# EAGLE design project1 (EAGLE 9.5.0)
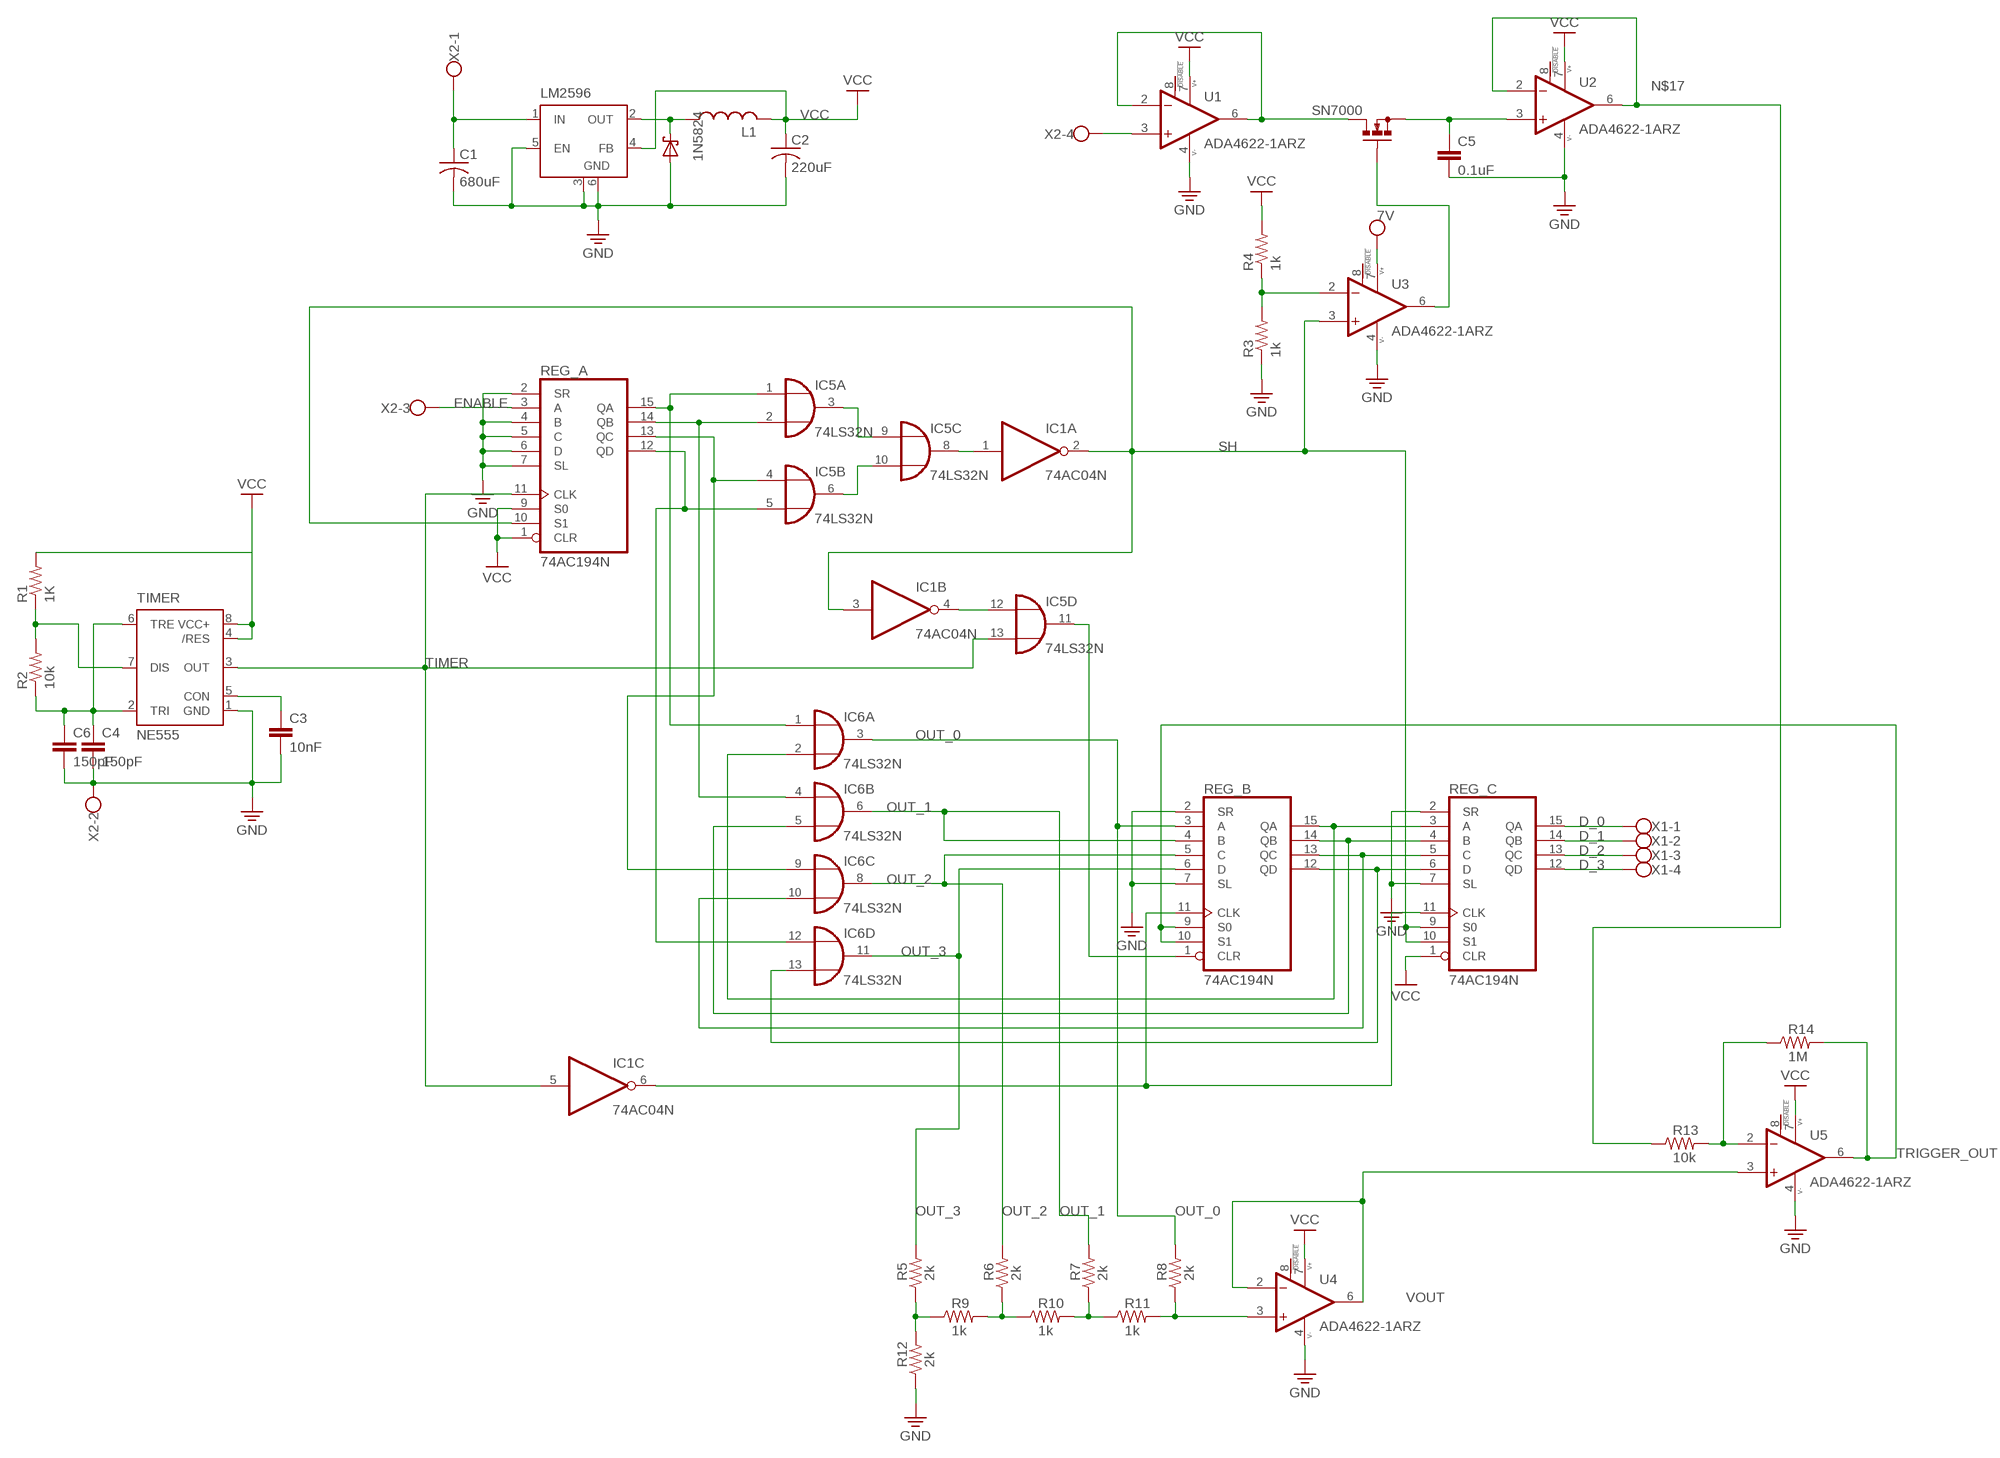
[diagram p0: schematic, sheet 1]

## Parts
1N5824  SCHOTTKY-DIODECB417-15  [CB417-15]
C1  680uF  C-US025-024X044  [C025-024X044]
C2  220uF  C-US025-024X044  [C025-024X044]
C3  10nF  C-EU050-024X044  [C050-024X044]
C4  150pF  C-EU050-024X044  [C050-024X044]
C5  0.1uF  C-EU050-024X044  [C050-024X044]
C6  150pF  C-EU050-024X044  [C050-024X044]
IC1  74AC04N  [DIL14]
IC5  74LS32N  [DIL14]
IC6  74LS32N  [DIL14]
L1  L-US0204/7  [0204/7]
LM2596  LM2596S  [TO263-5]
R1  1K  R-US_0204/7  [0204/7]
R2  10k  R-US_0204/7  [0204/7]
R3  1k  R-US_0204/7  [0204/7]
R4  1k  R-US_0204/7  [0204/7]
R5  2k  R-US_0204/7  [0204/7]
R6  2k  R-US_0204/7  [0204/7]
R7  2k  R-US_0204/7  [0204/7]
R8  2k  R-US_0204/7  [0204/7]
R9  1k  R-US_0204/7  [0204/7]
R10  1k  R-US_0204/7  [0204/7]
R11  1k  R-US_0204/7  [0204/7]
R12  2k  R-US_0204/7  [0204/7]
R13  10k  R-US_0204/7  [0204/7]
R14  1M  R-US_0204/7  [0204/7]
REG_A  74AC194N  [DIL16]
REG_B  74AC194N  [DIL16]
REG_C  74AC194N  [DIL16]
SN7000  BS170  [SOT54E]
TIMER  NE555  [DIL-08]
U1  ADA4622-1ARZ  [SOIC127P600X175-8N]
U2  ADA4622-1ARZ  [SOIC127P600X175-8N]
U3  ADA4622-1ARZ  [SOIC127P600X175-8N]
U4  ADA4622-1ARZ  [SOIC127P600X175-8N]
U5  ADA4622-1ARZ  [SOIC127P600X175-8N]
X1  W237-4  [W237-4]
X2  W237-4  [W237-4]

## Nets
D_0: REG_C.15(QA) X1.1
D_1: REG_C.14(QB) X1.2
D_2: REG_C.13(QC) X1.3
D_3: REG_C.12(QD) X1.4
ENABLE: REG_A.3(A) X2.3
GND: 1N5824.A C1.2 C2.2 C3.2 C4.2 C5.2 C6.2 LM2596.3(GND) LM2596.5(EN) LM2596.6(GND) R3.1 R12.1 REG_A.2(SR) REG_A.4(B) REG_A.5(C) REG_A.6(D) REG_A.7(SL) REG_B.2(SR) REG_B.7(SL) REG_C.2(SR) REG_C.7(SL) TIMER.1(GND) U1.4(V-) U2.4(V-) U3.4(V-) U4.4(V-) U5.4(V-) X2.2
N$1: IC5.1(A:I0) IC6.1(A:I0) REG_A.15(QA)
N$2: IC5.2(A:I1) IC6.4(B:I0) REG_A.14(QB)
N$3: IC5.4(B:I0) IC6.9(C:I0) REG_A.13(QC)
N$4: IC5.5(B:I1) IC6.12(D:I0) REG_A.12(QD)
N$5: IC5.6(B:O) IC5.10(C:I1)
N$6: IC5.3(A:O) IC5.9(C:I0)
N$7: IC1.1(A:I) IC5.8(C:O)
N$8: IC1.4(B:O) IC5.12(D:I0)
N$10: C3.1 TIMER.5(CON)
N$14: IC5.11(D:O) REG_B.1(CLR)
N$15: R1.1 R2.2 TIMER.7(DIS)
N$16: C4.1 C6.1 R2.1 TIMER.2(TRI) TIMER.6(TRE)
N$17: R13.1 U2.2(-IN) U2.6(OUT)
N$21: IC1.6(C:O) REG_B.11(CLK) REG_C.11(CLK)
N$22: 1N5824.C L1.1 LM2596.2(OUT)
N$23: SN7000.D U1.2(-IN) U1.6(OUT)
N$24: R3.2 R4.1 U3.2(-IN)
N$25: R6.1 R9.2 R10.1
N$26: C5.1 SN7000.S U2.3(+IN)
N$27: SN7000.G U3.6(OUT)
N$28: R7.1 R10.2 R11.1
N$29: R5.1 R9.1 R12.2
N$30: R8.1 R11.2 U4.3(+IN)
N$31: R13.2 R14.1 U5.2(-IN)
O0: IC6.2(A:I1) REG_B.15(QA) REG_C.3(A)
O1: IC6.5(B:I1) REG_B.14(QB) REG_C.4(B)
O2: IC6.10(C:I1) REG_B.13(QC) REG_C.5(C)
O3: IC6.13(D:I1) REG_B.12(QD) REG_C.6(D)
OUT_0: IC6.3(A:O) R8.2 REG_B.3(A)
OUT_1: IC6.6(B:O) R7.2 REG_B.4(B)
OUT_2: IC6.8(C:O) R6.2 REG_B.5(C)
OUT_3: IC6.11(D:O) R5.2 REG_B.6(D)
SH: IC1.2(A:O) IC1.3(B:I) REG_A.10(S1) REG_C.9(S0) REG_C.10(S1) U3.3(+IN)
TIMER: IC1.5(C:I) IC5.13(D:I1) REG_A.11(CLK) TIMER.3(OUT)
TRIGGER_OUT: R14.2 REG_B.9(S0) REG_B.10(S1) U5.6(OUT)
V_IN: U1.3(+IN) X2.4
VCC: C2.1 L1.2 LM2596.4(FB) R1.2 R4.2 REG_A.1(CLR) REG_A.9(S0) REG_C.1(CLR) TIMER.4(/RES) TIMER.8(VCC+) U1.7(V+) U2.7(V+) U3.7(V+) U4.7(V+) U5.7(V+) ; supply symbol labelled 7V
VIN: C1.1 LM2596.1(IN) X2.1
VOUT: U4.2(-IN) U4.6(OUT) U5.3(+IN)
Unconnected: IC1.8(D:O) IC1.9(D:I) IC1.10(E:O) IC1.11(E:I) IC1.12(F:O) IC1.13(F:I) U1.8(!DISABLE) U2.8(!DISABLE) U3.8(!DISABLE) U4.8(!DISABLE) U5.8(!DISABLE)

## Power pins joined to a net without a drawn wire
GND: IC1.7(P:GND) IC5.7(P:GND) IC6.7(P:GND) REG_A.8(GND) REG_B.8(GND) REG_C.8(GND)
VCC: IC1.14(P:VCC) IC5.14(P:VCC) IC6.14(P:VCC) REG_A.16(VCC) REG_B.16(VCC) REG_C.16(VCC)

## Library data of the parts
1N5824 = adafruit:SCHOTTKY-DIODE: Schottky Diode
C1 C2 = adafruit:C-US: CAPACITOR, American symbol
C3-C6 = rcl:C-EU: CAPACITOR, European symbol; SPICEPREFIX: C
IC1 = 74xx-eu:74*04: Hex INVERTER
IC5 IC6 = 74xx-eu:74*32: Quad 2-input OR gate
L1 = rcl:L-US: INDUCTOR, American symbol; SPICEPREFIX: L
LM2596 = linear:LM2596S: STEP-DOWN VOLTAGE REGULATOR
R1-R14 = BeagleBone_Black_Wireless:R-US_: RESISTOR, American symbol
REG_A REG_B REG_C = 74xx-eu:74*194: 4-bit bidirectional SHIFT REGISTER
SN7000 = transistor-small-signal:BS170: N-CHANNEL MOS FET
TIMER = st-microelectronics:NE555: General purpose bipolar Timer; MF: Arrow Electronics; MPN: NE555N; OC_FARNELL: 1467742; OC_NEWARK: 89K1486
U1-U5 = ADA4622-1ARZ:ADA4622-1ARZ: J-FET Amplifier 1 Circuit Rail-to-Rail 8-SOIC Check prices <https://pricing.snapeda.com/parts/ADA4622-1ARZ/Analog%20Devices/view-part?ref=eda>; AVAILABILITY: Good; DESCRIPTION: J-FET Amplifier 1 Circuit Rail-to-Rail 8-SOIC; MF: Analog Devices; MP: ADA4622-1ARZ; PACKAGE: SOIC-8 Analog Devices; PRICE: None; PURCHASE-URL: https://pricing.snapeda.com/search/part/ADA4622-1ARZ/?ref=eda
X1 X2 = con-wago-500:W237-4: WAGO SCREW CLAMP; OC_FARNELL: unknown; OC_NEWARK: unknown

## Net classes
0 default: width 0.381 mm, clearance 0.889 mm
1 ground: width 0.381 mm, clearance 0.889 mm

## Board
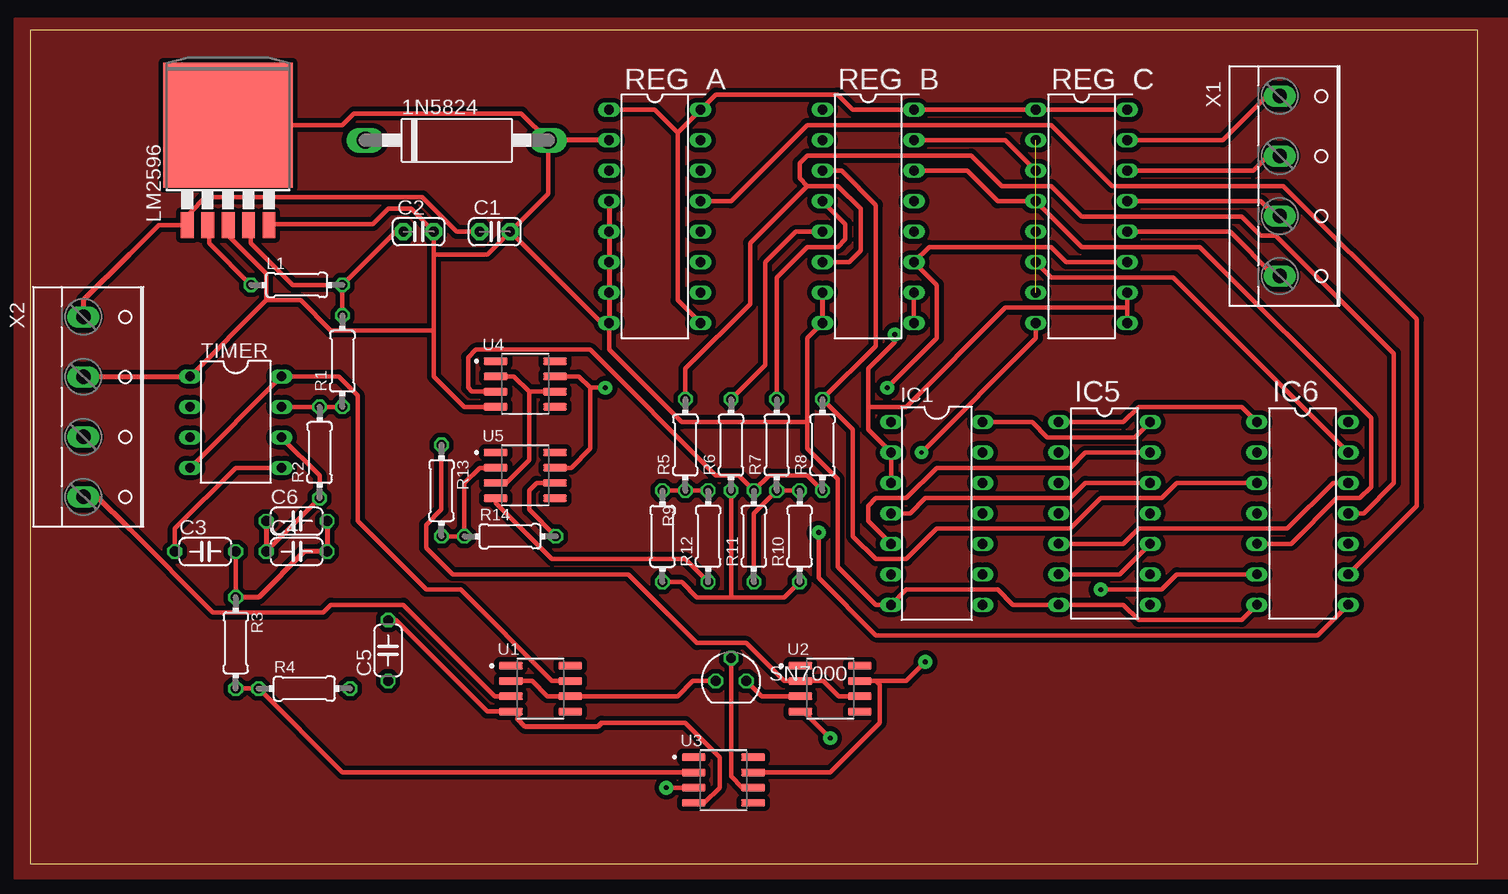
[diagram p1: board, top side]
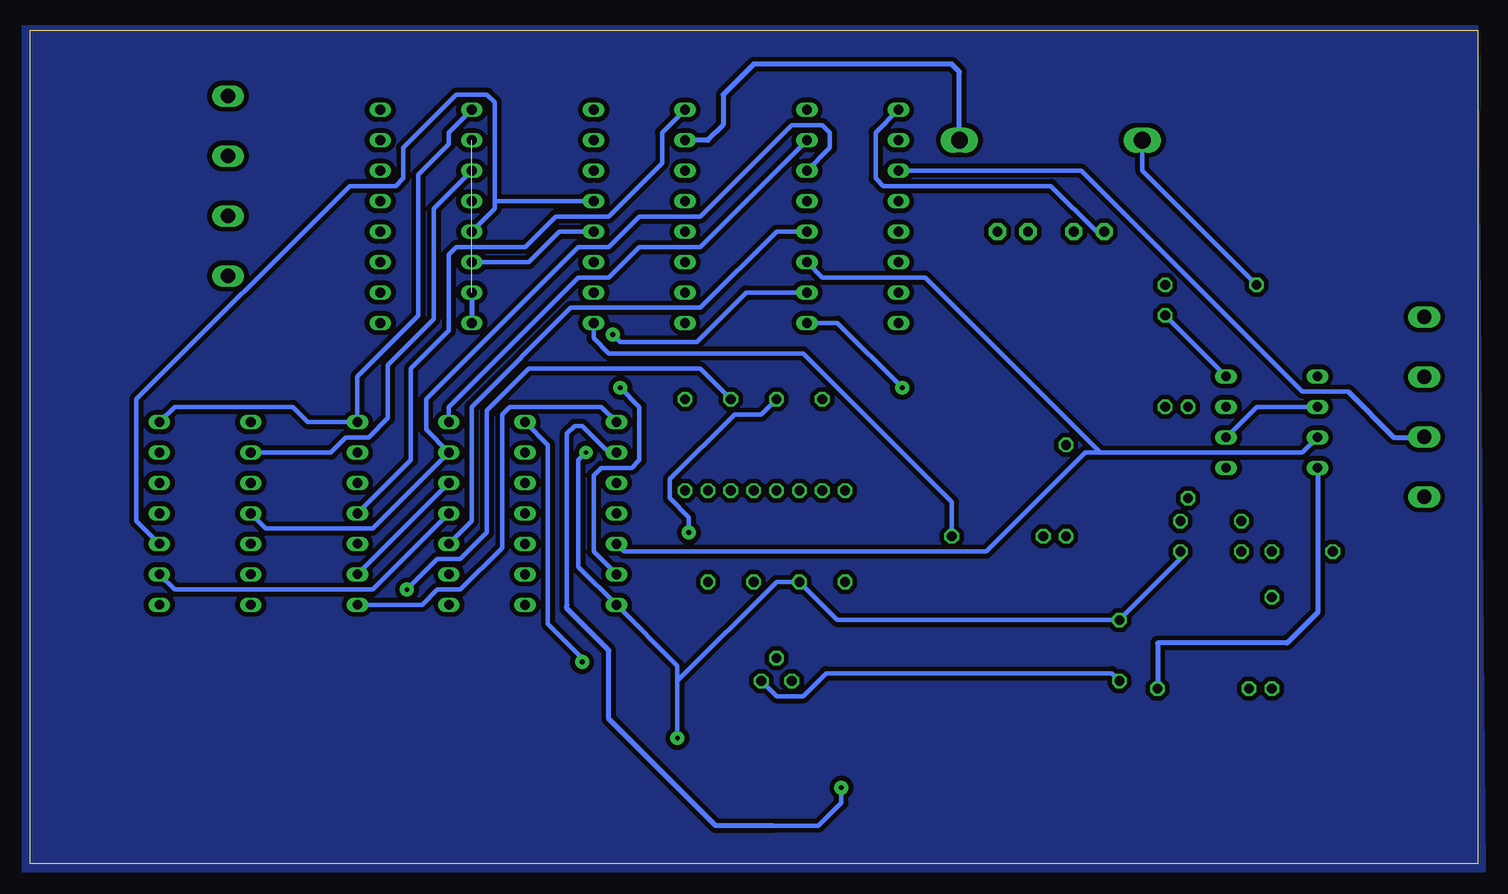
[diagram p2: board, bottom side, seen from below]

Size 120.63 x 69.52 mm. Coordinates in mm from the lower left corner, seen from the top.
Outline: 0,0 120.63,0 120.63,69.52 0,69.52 0,0
Copper layers (1*16): Top 0.035mm / dielectric 1.5mm / Bottom 0.035mm
Design rules "OthermillDRC_1_64_v2": minimum track width 16mil, minimum drill 31mil, track to track 0.39878125mm, track to pad 0.39878125mm, pad to pad 0.39878125mm, via to via 0.39878125mm, smd to smd 0mil, copper to edge 0mil, drill to drill 1mil, minimum pad ring 0mil, minimum via ring 15mil, stop-mask expansion 1mil, vias tented up to drill 30mil, thermal gap 10mil

### Footprints (pad centres in the part's own frame; a part is rotated, then mirrored left to right if it is on the bottom)
CB417-15 = drill 1.397 long: A 7.62,0; C -7.62,0
C025-024X044 = drill 0.813 pad 1.422 octagon: 1 -1.27,0; 2 1.27,0
C050-024X044 = drill 0.813 octagon: 1 -2.54,0; 2 2.54,0
DIL14 = drill 0.813 long: 1 -7.62,-3.81; 2 -5.08,-3.81; 3 -2.54,-3.81; 4 0,-3.81; 5 2.54,-3.81; 6 5.08,-3.81; 7 7.62,-3.81; 8 7.62,3.81; 9 5.08,3.81; 10 2.54,3.81; 11 0,3.81; 12 -2.54,3.81; 13 -5.08,3.81; 14 -7.62,3.81
DIL14' = drill 0.8 long: 1 -7.62,-3.81; 2 -5.08,-3.81; 3 -2.54,-3.81; 4 0,-3.81; 5 2.54,-3.81; 6 5.08,-3.81; 7 7.62,-3.81; 8 7.62,3.81; 9 5.08,3.81; 10 2.54,3.81; 11 0,3.81; 12 -2.54,3.81; 13 -5.08,3.81; 14 -7.62,3.81
0204/7 = drill 0.813 octagon: 1 -3.81,0; 2 3.81,0
TO263-5 = smd 1.067 x 2.159: 1 -3.404,-5.791; 2 -1.702,-5.791; 3 0,-5.791; 4 1.702,-5.791; 5 3.404,-5.791 | smd 10.8 x 10.41: 6 0,2.54
DIL16 = drill 0.813 long: 1 -8.89,-3.81; 2 -6.35,-3.81; 3 -3.81,-3.81; 4 -1.27,-3.81; 5 1.27,-3.81; 6 3.81,-3.81; 7 6.35,-3.81; 8 8.89,-3.81; 9 8.89,3.81; 10 6.35,3.81; 11 3.81,3.81; 12 1.27,3.81; 13 -1.27,3.81; 14 -3.81,3.81; 15 -6.35,3.81; 16 -8.89,3.81
SOT54E = drill 0.813 octagon: D -1.27,0; G 0,1.905; S 1.27,0
DIL-08 = drill 0.813 long: 1 -3.81,-3.81; 2 -1.27,-3.81; 3 1.27,-3.81; 4 3.81,-3.81; 5 3.81,3.81; 6 1.27,3.81; 7 -1.27,3.81; 8 -3.81,3.81
SOIC127P600X175-8N = smd 1.97 x 0.6: 1 -2.475,1.905; 2 -2.475,0.635; 3 -2.475,-0.635; 4 -2.475,-1.905; 5 2.475,-1.905; 6 2.475,-0.635; 7 2.475,0.635; 8 2.475,1.905
W237-4 = drill 1.194 long: 1 -7.5,-1.27; 2 -2.5,-1.27; 3 2.5,-1.27; 4 7.5,-1.27

### Placement (x,y rotation side)
1N5824  35.56,60.33 0 top
C1  38.74,52.7 0 top
C2  32.38,52.7 0 top
C3  14.61,26.03 0 top
C4  22.23,26.03 0 top
C5  29.85,17.78 90 top
C6  22.23,28.57 0 top
IC1  75.56,29.21 270 top
IC5  74LS32N  [DIL14']  89.53,29.21 270 top
IC6  74LS32N  [DIL14']  106.04,29.21 270 top
L1  22.23,48.26 0 top
LM2596  16.51,59.05 0 top
R1  26.04,41.91 90 top
R2  24.13,34.29 90 top
R3  17.15,18.41 270 top
R4  22.86,14.6 0 top
R5  54.61,34.92 90 top
R6  58.42,34.92 90 top
R7  62.23,34.92 90 top
R8  66.04,34.92 90 top
R9  52.71,27.3 270 top
R10  64.13,27.3 90 top
R11  60.32,27.3 90 top
R12  56.52,27.3 90 top
R13  34.29,31.11 270 top
R14  40.01,27.3 0 top
REG_A  52.07,53.97 270 top
REG_B  69.85,53.97 270 top
REG_C  87.63,53.97 270 top
SN7000  58.42,15.24 0 top
TIMER  17.15,36.83 270 top
U1  42.55,14.6 0 top
U2  66.68,14.6 0 top
U3  57.79,6.98 0 top
U4  41.27,40 0 top
U5  41.27,32.38 0 top
X1  105.41,56.52 270 top
X2  5.72,38.1 270 top

### Tracks (layer width: path | path; a pad name or v marks a point on that pad's centre or on a via)
D_0
  Top 0.381: REG_C.15 99.38,60.33 103.07,64.02 X1.1
D_1
  Top 0.381: REG_C.14 101.92,57.78 103.15,59.02 X1.2
D_2
  Top 0.381: REG_C.13 102.55,55.25 103.78,54.02 X1.3
D_3
  Top 0.381: REG_C.12 100.01,52.7 103.7,49.02 X1.4
ENABLE
  Bottom 0.381: REG_A.3 33.02,57.78 14.61,39.37 10.8,39.37
  Bottom 0.406: 10.8,39.37 6.98,35.56 4.48,35.56 X2.3
GND  (via drill 0.35, 0.4)  (1 unrouted)
  Top 0.381: LM2596.3 16.51,52.39 19.69,49.21 19.69,46.99 | TIMER.1 19.69,46.99 | U4.4 36.2,38.1 33.66,40.64 33.66,44.45 | 33.66,50.8 C2.2 31.75,54.61 29.85,54.61 28.57,53.34 20,53.34 LM2596.5 | 33.66,50.8 33.66,44.45 | 19.69,46.99 22.54,46.99 25.08,44.45 33.66,44.45 | C1.2 47.63,45.08 REG_A.8 48.26,42.86 54.29,36.83 64.77,36.83 | C1.2 43.18,55.88 1N5824.A 40.96,62.55 26.99,62.55 26.04,61.59 LM2596.6 | 33.66,50.8 38.1,50.8 C1.2 | C3.2 R3.1 | U1.4 38.1,12.7 30.48,20.32 C5.2 | U3.4 56.2,5.08 57.47,6.35 57.47,8.89 54.61,11.75 47.63,11.75 | U5.4 38.8,30.1 43.5,25.4 54.61,25.4 R12.1 | IC6.7 100.97,20.32 92.39,20.32 91.12,21.59 IC5.7 81.91,21.59 80.65,22.86 73.03,22.86 IC1.7 70.49,21.59 67.31,24.77 67.31,32.07 64.77,34.61 64.77,36.83 | U2.4 64.45,12.7 v66.68,10.48 | REG_B.8 64.77,43.81 64.77,36.83 | REG_C.8 83.82,43.81 v74.3,34.29
  Top 0.406: C6.2 C4.2 22.86,26.03 19.05,22.23 R3.1 | 47.63,11.75 47.31,11.43 41.27,11.43 40.64,12.06 40.64,12.7 U1.4 | TIMER.1 13.3,40.6 X2.2 | REG_A.2 1N5824.A | REG_A.8 REG_A.7 REG_A.6 REG_A.5 REG_A.4 | REG_B.7 REG_B.8
  Bottom 0.381: C4.2 24.77,25.4 C5.2 53.34,20.32 R12.1 58.42,23.49 66.68,15.24 | 66.68,15.24 66.68,16.51 IC1.7 74.93,24.77 74.93,33.66 v74.3,34.29 | 66.68,15.24 v66.68,10.48
  Bottom 0.406: REG_C.7 REG_C.8 | 1N5824.A 43.18,66.04 43.82,66.67 60.32,66.67 62.87,64.14 62.87,61.59 64.13,60.33 REG_B.2
MASK
  pour Bottom: 0,69.85 121.28,69.85 121.28,-0.64 -0.63,-0.64 0,69.85
MASK_1
  pour Top: -1.27,70.48 125.09,70.48 127,68.58 127,-1.27 -1.27,-1.27
N$1
  Top 0.381: IC5.1 91.12,36.83 92.39,38.1 100.97,38.1 IC6.1
  Bottom 0.381: REG_A.15 64.77,51.44 69.85,51.44 72.39,48.89 74.93,48.89 85.72,38.1 IC5.1
N$2
  Bottom 0.381: IC6.4 100.97,27.94 92.07,27.94 IC5.2 87.63,36.2 87.63,38.73 74.93,51.44 72.39,51.44 69.85,53.97 64.77,53.97 57.15,61.59 54.61,61.59 53.98,60.96 53.98,59.69 REG_A.14
N$3
  Top 0.381: REG_A.13 58.42,55.25 64.77,61.59 85.09,61.59 90.17,56.52 104.46,56.52 115.57,45.4 115.57,29.84 IC6.9
  Bottom 0.381: IC5.4 92.07,22.86 108.59,22.86 IC6.9
N$4
  Top 0.381: IC5.5 91.12,26.67 92.39,27.94 104.78,27.94 108.59,31.75 IC6.12
  Bottom 0.381: REG_A.12 58.42,52.7 64.77,46.36 75.56,46.36 83.82,38.1 83.82,28.57 IC5.5
N$5
  Top 0.381: IC5.6 90.81,24.13 IC5.10
N$6
  Bottom 0.381: IC5.9 IC5.3
N$7
  Bottom 0.381: IC5.8 87.95,21.59 86.68,22.86 84.77,22.86 81.28,26.35 81.28,37.47 80.65,38.1 73.03,38.1 IC1.1
N$8
  Top 0.381: IC5.12 87.95,31.75 86.68,30.48 74.61,30.48 73.34,29.21 IC1.4
N$10
  Top 0.381: TIMER.5 17.15,33.02 12.07,27.94 C3.1
N$14
  Bottom 0.381: IC5.11 88.9,33.66 88.9,41.27 85.72,44.45 85.72,50.8 85.09,51.44 79.38,51.44 76.84,53.97 72.39,53.97 67.94,58.42 67.94,60.96 REG_B.1
N$15
  Top 0.381: TIMER.7 R2.2 R1.1
N$16
  Top 0.381: C4.1 R2.1 24.13,32.38 TIMER.6
  Top 0.406: C6.1 C4.1
  Bottom 0.381: TIMER.2 18.41,38.1 TIMER.6
N$17
  Top 0.381: U2.6 67.38,13.97 66.1,15.24 U2.2 62.87,15.24 59.69,18.41 55.56,18.41 49.85,24.13 35.24,24.13 33.02,26.35 33.02,28.26 34.29,29.53 R13.1
N$21  (via drill 0.4)
  Top 0.381: v71.44,39.69 75.56,43.81 75.56,48.26 REG_B.11 74.93,51.44 85.09,51.44 86.36,50.16 REG_C.11
  Bottom 0.381: IC1.6 73.66,26.03 73.66,32.38 73.03,33.02 70.49,33.02 69.85,33.66 69.85,38.1 v71.44,39.69
N$22
  Top 0.381: L1.1 14.92,51.75 14.92,53.02 LM2596.2
  Bottom 0.381: 1N5824.C 27.94,57.78 L1.1
N$23
  Top 0.381: U1.2 41.85,15.24 43.12,13.97 U1.6 53.98,13.97 55.24,15.24 SN7000.D
N$24
  Top 0.381: U3.2 26.04,7.62 R4.1 R3.2
N$25
  Top 0.381: R9.2 54.29,23.49 55.56,22.23 58.42,22.23 | 58.42,22.23 62.87,22.23 R10.1 | 58.42,22.23 R6.1
N$26
  Top 0.381: U2.3 60.96,13.97 SN7000.S
  Bottom 0.381: C5.1 30.48,15.88 54.29,15.88 56.2,13.97 58.42,13.97 SN7000.S
N$27
  Top 0.381: U3.6 59.37,6.35 58.42,7.3 SN7000.G
N$28
  Top 0.381: R11.1 60.32,29.21 R7.1 R10.2
N$29
  Top 0.381: R9.1 R5.1 R12.2
N$30
  Top 0.381: U4.3 36.83,39.37 36.51,39.69 36.51,42.23 37.15,42.86 46.67,42.86 57.15,32.38 59.05,32.38 R11.2 61.6,32.38 64.77,32.38 R8.1
N$31
  Top 0.381: U5.2 37.46,33.02 36.2,31.75 R14.1 R13.2
O0
  Top 0.381: REG_B.15 81.28,60.33 REG_C.3
  Bottom 0.381: IC6.2 95.57,34.29 94.3,35.56 92.39,35.56 90.81,37.15 90.81,41.59 87,45.4 87,54.61 REG_C.3
O1
  Top 0.381: IC6.5 105.09,26.67 108.9,30.48 110.81,30.48 111.76,31.43 111.76,37.15 97.47,51.44 87.63,51.44 REG_C.4 80.65,55.25 78.1,57.78 REG_B.14
O2
  Bottom 0.381: IC6.10 111.76,28.57 111.76,38.73 93.98,56.52 90.17,56.52 89.53,57.15 89.53,59.69 85.09,64.14 82.55,64.14 81.91,63.5 81.91,55.25 | 81.91,55.25 81.91,54.61 REG_C.5 | 81.91,55.25 REG_B.13
O3
  Top 0.381: IC6.13 95.25,48.89 85.09,48.89 REG_C.6
  Bottom 0.381: REG_B.12 76.52,52.7 79.06,50.16 REG_C.6
OUT_0
  Top 0.381: IC6.3 95.57,31.75 94.3,30.48 89.22,30.48 86.68,27.94 75.56,27.94 73.03,25.4 70.49,25.4 68.58,27.3 68.58,36.2 R8.2 70.49,43.18 70.49,54.93 67.63,57.78 REG_B.3
OUT_1  (via drill 0.4)
  Top 0.381: IC6.6 95.57,24.13 94.3,22.86 v89.22,22.86 | REG_B.4 67.94,53.34 67.94,52.07 67.31,51.44 64.77,51.44 62.23,48.89 R7.2
  Bottom 0.381: v89.22,22.86 86.68,25.4 84.77,25.4 82.55,27.62 82.55,37.78 79.06,41.27 64.77,41.27 R7.2
OUT_2  (via drill 0.4)
  Top 0.381: IC6.8 107.31,19.05 70.49,19.05 65.72,23.81 v65.72,27.62 | REG_B.5 63.82,52.7 61.28,50.16 61.28,41.59 R6.2
  Bottom 0.381: v65.72,27.62 65.72,28.89 67.31,30.48 67.31,32.07 61.91,37.47 59.69,37.47 R6.2
OUT_3
  Top 0.381: IC6.11 111.12,29.21 113.66,31.75 113.66,42.55 103.82,52.39 102.55,52.39 100.97,53.97 87.63,53.97 85.09,56.52 80.96,56.52 78.42,59.05 64.77,59.05 64.13,58.42 64.13,57.15 64.77,56.52 | 64.77,56.52 67.31,56.52 69.22,54.61 69.22,51.12 68.26,50.16 REG_B.6 | R5.2 54.61,41.27 60.01,46.67 60.01,51.75 64.77,56.52
SH  (via drill 0.4)
  Top 0.381: REG_C.10 91.44,46.36 | 91.44,46.36 REG_C.9 | v72.07,44.13 72.07,43.5 69.85,41.27 69.85,38.1 | 69.85,38.1 69.85,36.2 IC1.2 IC1.3 | 91.44,46.36 81.28,46.36 73.03,38.1 69.85,38.1 | v53.02,6.35 U3.3
  Bottom 0.381: 75.88,21.59 75.88,35.88 75.25,36.51 74.61,36.51 72.39,34.29 IC1.2 | REG_A.10 60.96,47.62 65.09,43.5 71.44,43.5 v72.07,44.13 | 58.74,3.17 54.93,3.17 53.02,5.08 v53.02,6.35
  Bottom 0.406: 58.74,3.17 63.5,3.17 72.39,12.06 72.39,17.78 75.88,21.27 75.88,21.59
TIMER
  Top 0.381: IC5.13 87.95,34.29 86.68,33.02 75.56,33.02 73.03,30.48 70.49,30.48 69.85,29.84 69.85,28.57 IC1.5
  Bottom 0.381: TIMER.3 14.61,34.29 31.43,34.29 | 31.43,34.29 32.7,34.29 40.96,26.03 71.12,26.03 IC1.5 | 31.43,34.29 46.04,48.89 54.61,48.89 REG_A.11
TRIGGER_OUT
  Top 0.381: REG_B.10 REG_B.9 | U5.6 42.23,31.75 41.59,31.11 41.59,29.53 R14.2
  Bottom 0.381: REG_B.9 73.66,43.81 72.39,42.55 56.2,42.55 43.82,30.16 R14.2
V_IN
  Top 0.381: U1.3 38.74,13.97 31.12,21.59 25.08,21.59 24.45,20.95 15.24,20.95 8.26,27.94
  Top 0.406: X2.4 5.6,30.6 8.26,27.94
VCC  (via drill 0.4)
  Top 0.381: L1.2 21.91,48.26 18.41,51.75 18.41,53.02 LM2596.4 | L1.2 R1.2 | C2.1 30.48,52.7 L1.2 | U1.7 43.5,15.24 35.88,22.86 33.02,22.86 27.3,28.57 27.3,39.05 25.72,40.64 TIMER.8 TIMER.4 | U3.7 66.68,7.62 70.8,11.75 70.8,14.92 70.49,15.24 | U2.7 70.49,15.24 | 70.49,15.24 73.03,15.24 v74.61,16.83 | IC1.14 83.5,36.83 84.77,35.56 92.07,35.56 IC5.14 | REG_C.16 REG_C.1 REG_B.16 68.58,62.86 67.31,64.14 57.15,64.14 REG_A.16 53.98,60.96 | U5.7 45.09,33.02 46.67,34.61 46.67,39.69 | 46.67,39.69 45.72,40.64 U4.7 | REG_A.9 53.98,46.99 53.98,60.96 | REG_A.1 52.07,62.86 53.98,60.96 | v47.94,39.69 46.67,39.69
  Bottom 0.381: TIMER.8 R1.2 | IC6.14 108.59,38.1 98.74,38.1 97.47,36.83 IC5.14 93.34,40.64 88.27,45.72 88.27,57.47 85.72,60.01 85.72,60.96 REG_C.1 | v74.61,16.83 74.61,17.14 77.47,20 77.47,34.92 IC1.14 | REG_A.9 53.34,45.08 v47.94,39.69 | C2.1 31.75,52.7 35.56,56.52 49.53,56.52 50.16,57.15 50.16,60.96 REG_A.1
  Bottom 0.406: TIMER.4 13.34,20.95 15.88,18.41 26.67,18.41 R4.2
VIN
  Top 0.381: 8.26,50.8 10.72,53.26 LM2596.1 13.34,53.34 13.34,54.29 14.61,55.56 32.7,55.56 35.56,52.7 C1.1
  Top 0.406: 8.26,50.8 4.45,46.99 X2.1
VOUT
  Top 0.381: U5.3 39.69,31.75 41.59,33.66 41.59,39.37 | U4.6 41.59,39.37 | U4.2 40.32,40.64 41.59,39.37